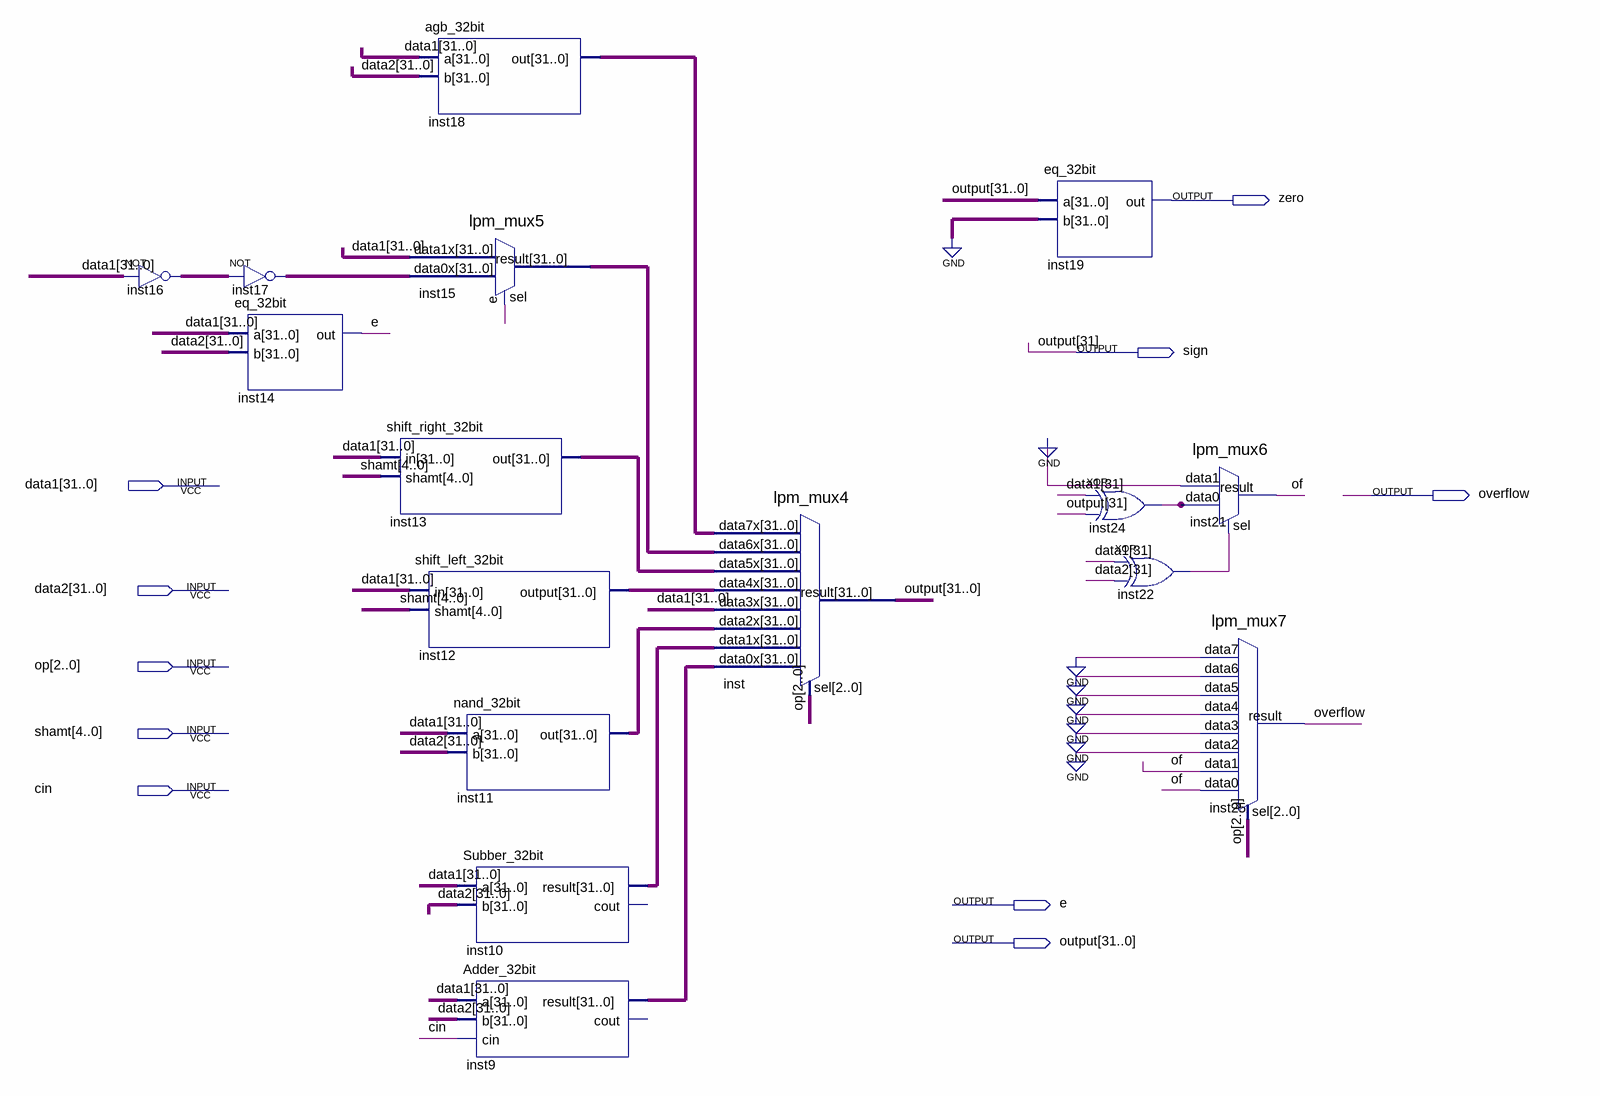
[diagram p0: schematic sheet]
// Quartus schematic ALU.bdf as structural Verilog: 16 symbols, 10 pins
module ALU (
  input  [31:0] data1,
  input  [31:0] data2,
  input  [2:0] op,
  input  [4:0] shamt,
  input  cin,
  output zero,
  output sign,
  output overflow,
  output e,
  output [31:0] \output 
);

  wire inst22_out, inst24_out, of;
  wire [31:0] inst9_result, inst10_result, inst11_out, inst12_output, inst13_out, inst15_result, inst16_out,
       inst17_out, inst18_out;

  assign inst16_out = ~data1;  // NOT inst16, 32 bits wide
  assign inst17_out = ~inst16_out;  // NOT inst17, 32 bits wide
  eq_32bit inst14 (.a(data1), .b(data2), .out(e));
  shift_right_32bit inst13 (.in(data1), .shamt(shamt), .out(inst13_out));
  agb_32bit inst18 (.a(data1), .b(data2), .out(inst18_out));
  lpm_mux5 inst15 (.data1x(data1), .data0x(inst17_out), .sel(e), .result(inst15_result));
  shift_left_32bit inst12 (.in(data1), .shamt(shamt), .\output (inst12_output));
  nand_32bit inst11 (.a(data1), .b(data2), .out(inst11_out));
  Subber_32bit inst10 (.a(data1), .b(data2), .result(inst10_result));  // open: cout
  Adder_32bit inst9 (.a(data1), .b(data2), .cin(cin), .result(inst9_result));  // open: cout
  lpm_mux4 inst (
    .data7x(inst18_out), .data6x(inst15_result), .data5x(inst13_out), .data4x(inst12_output), .data3x(data1),
    .data2x(inst11_out), .data1x(inst10_result), .data0x(inst9_result), .sel(op), .result(\output ));
  eq_32bit inst19 (.a(\output ), .b({32{1'b0}}), .out(zero));
  xor inst24 (inst24_out, data1[31], \output [31]);
  xor inst22 (inst22_out, data1[31], data2[31]);
  lpm_mux6 inst21 (.data1(1'b0), .data0(inst24_out), .sel(inst22_out), .result(of));
  lpm_mux7 inst25 (
    .data7(1'b0), .data6(1'b0), .data5(1'b0), .data4(1'b0), .data3(1'b0), .data2(1'b0), .data1(of),
    .data0(of), .sel(op), .result(overflow));

  assign sign = \output [31];
endmodule
